# Altium schematic sheet Schematic.SchDoc
size A2
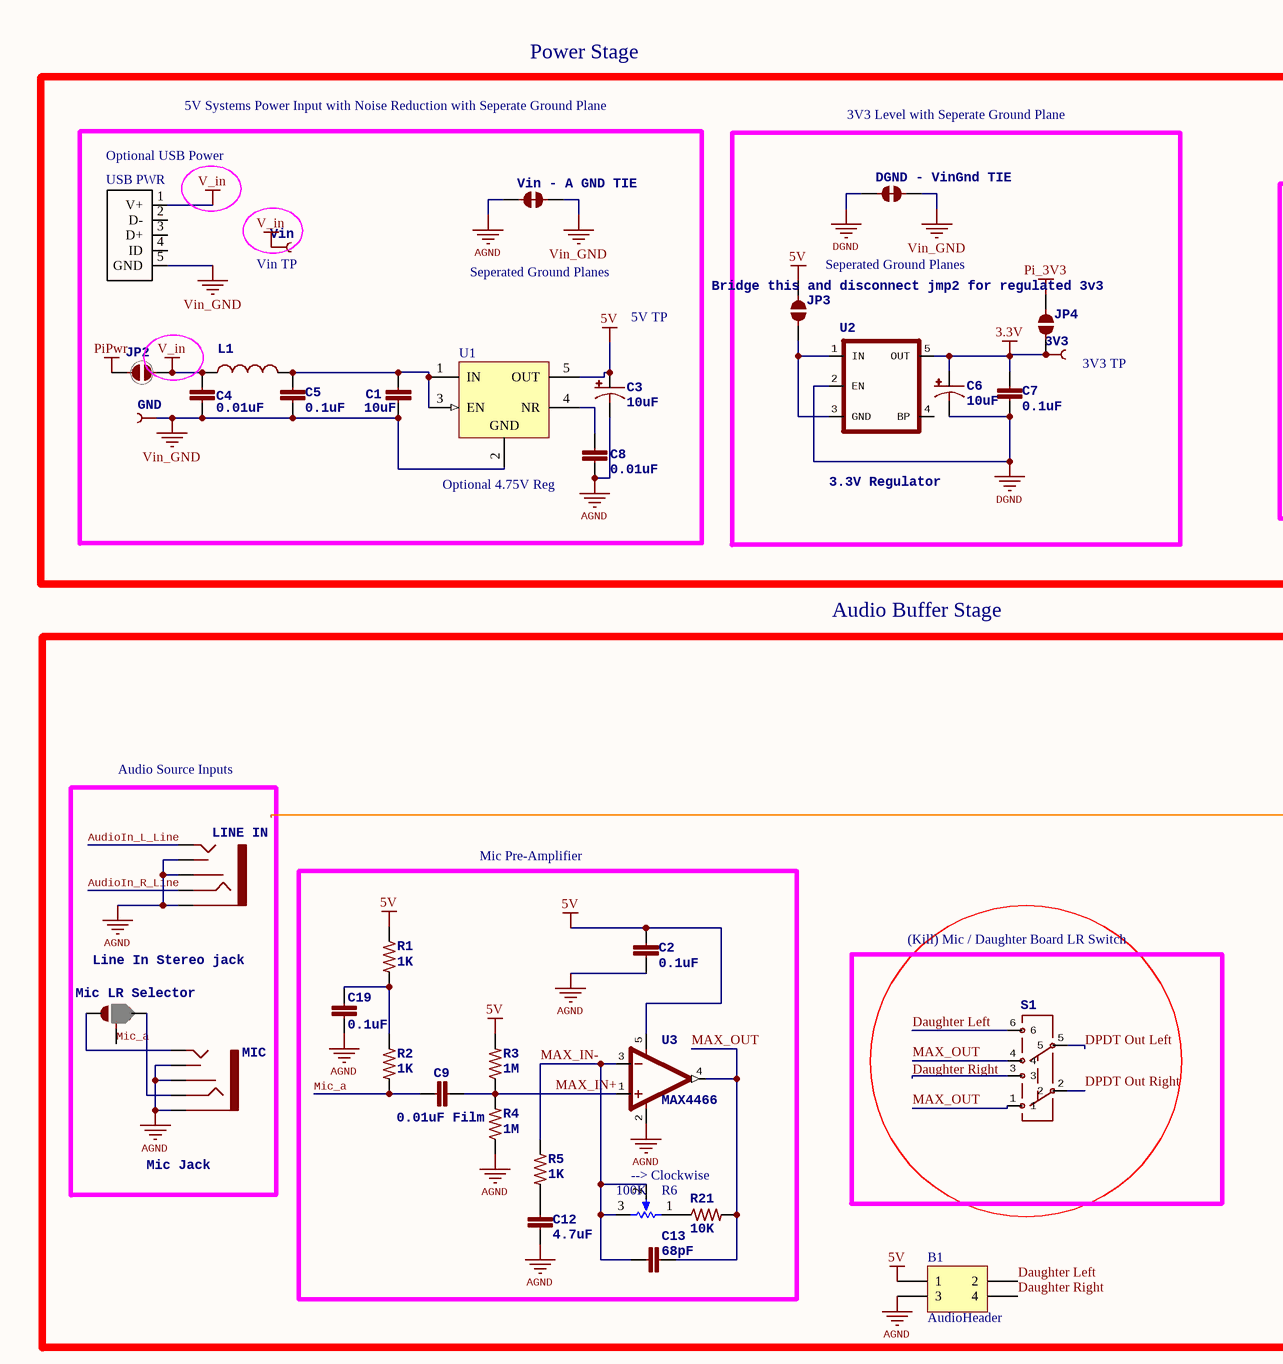
[diagram p0: Schematic.SchDoc, top left]
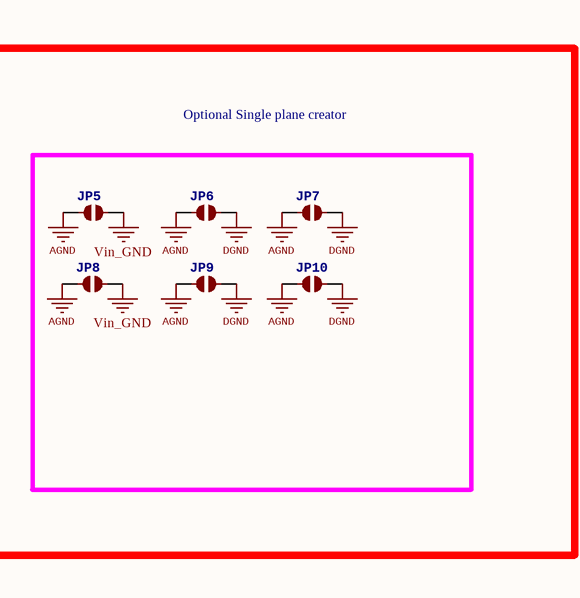
[diagram p1: Schematic.SchDoc, top right]
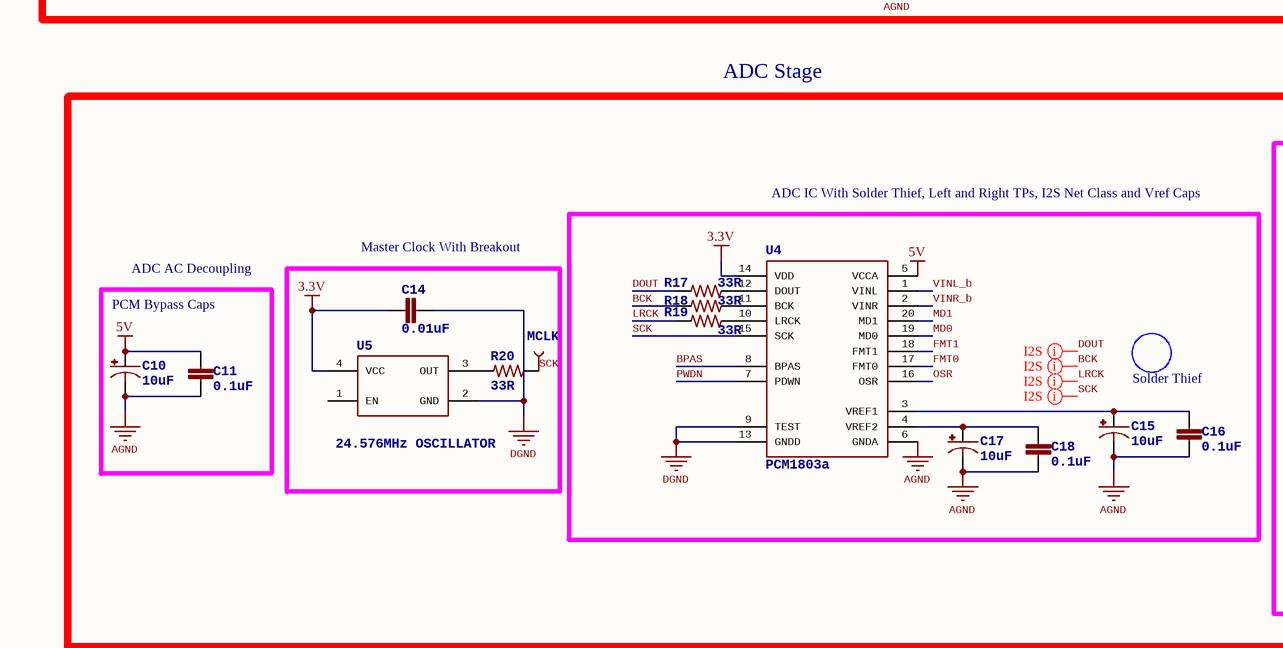
[diagram p2: Schematic.SchDoc, bottom left]
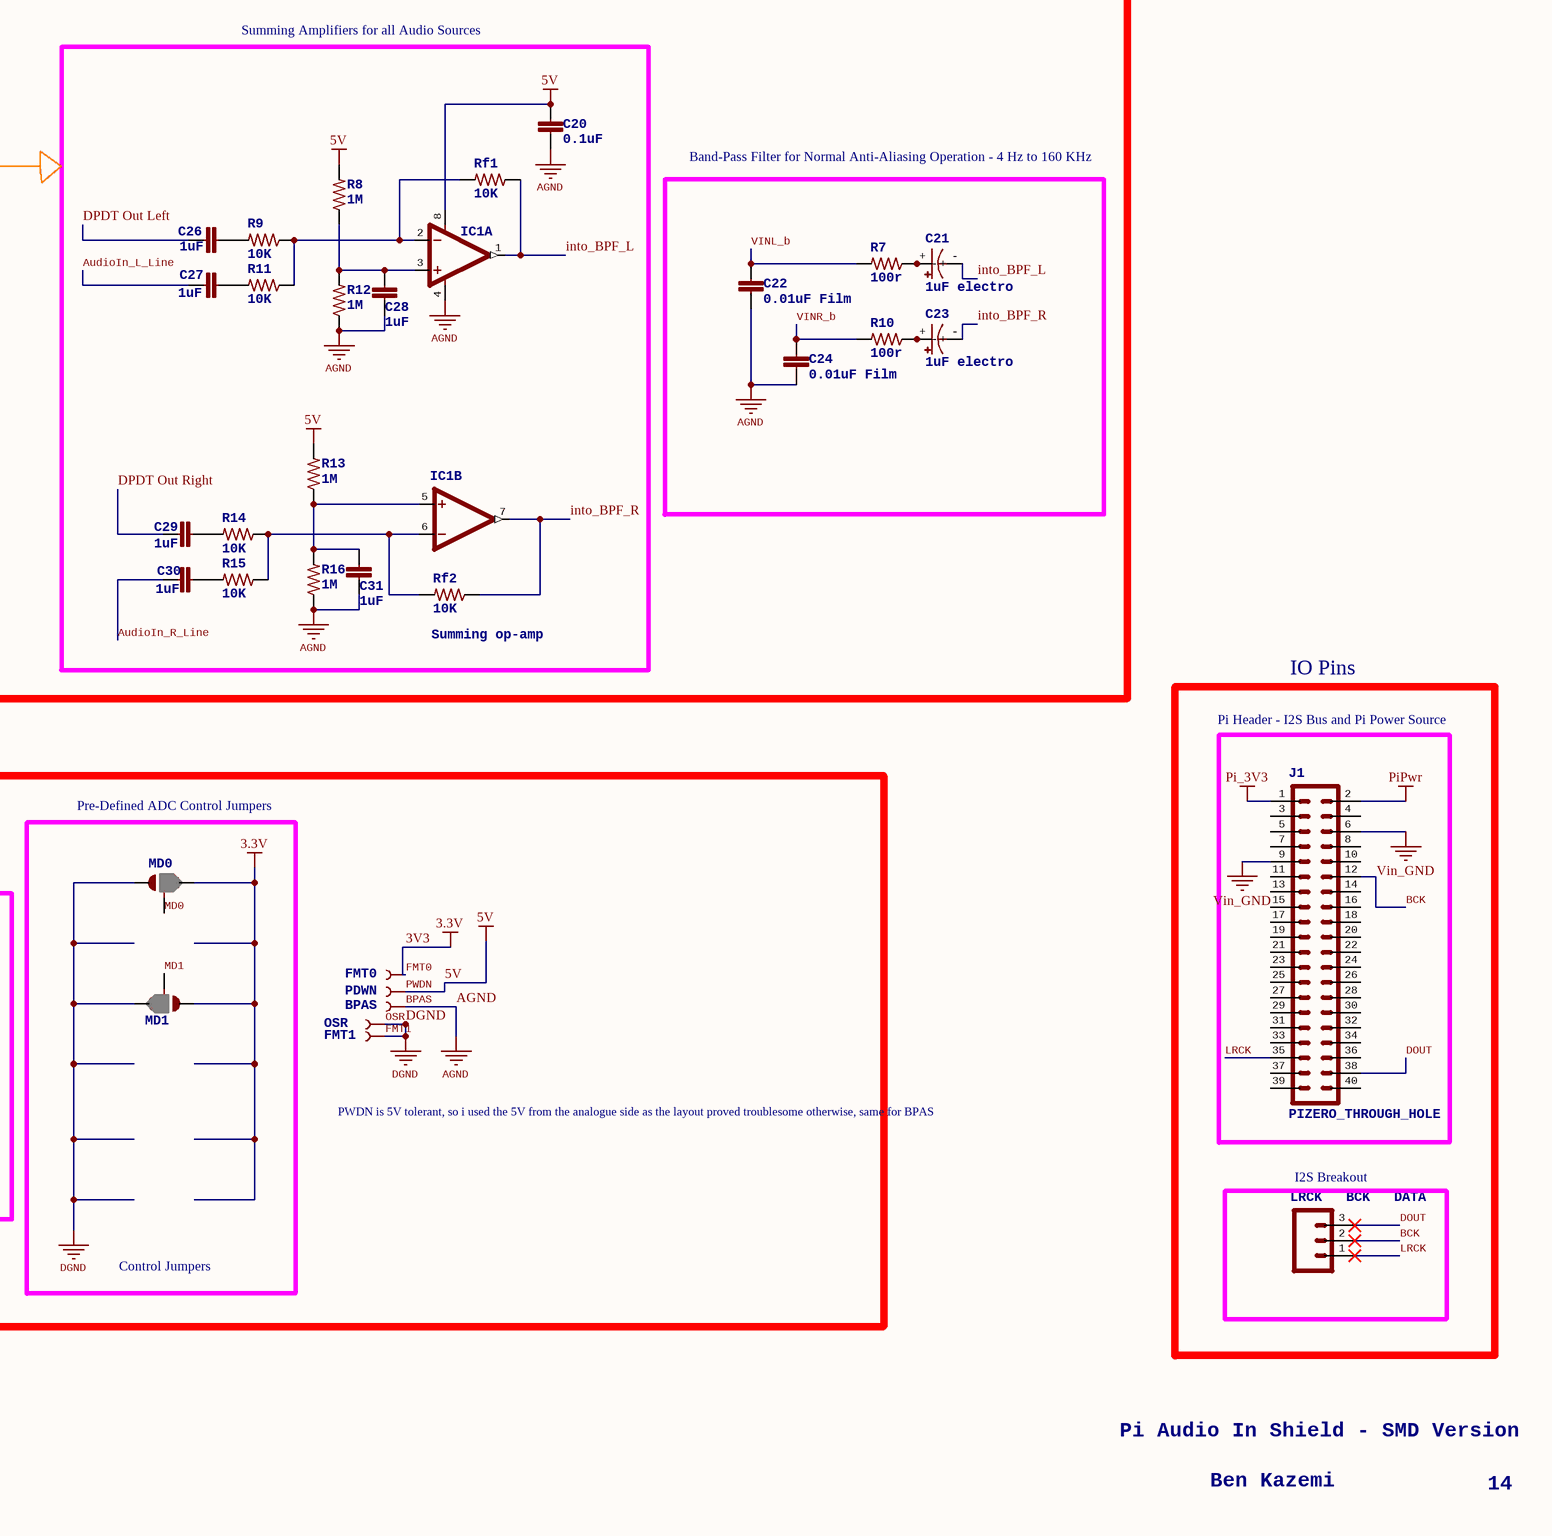
[diagram p3: Schematic.SchDoc, bottom right]

## Parts
3V3  Bare copper test points for troubleshooting or ICT  [PAD.03X.03]  (value not drawn)
B1  AudioHeader  [HDR2X2]
BPAS  Bare copper test points for troubleshooting or ICT  [PAD.02X.02]  (value not drawn)
C1  10uF  [0603-CAP]
C2  0.1uF  [0603-CAP]
C3  10uF  [EIA3216]
C4  0.01uF  [0603-CAP]
C5  0.1uF  [0603-CAP]
C6  10uF  [EIA3216]
C7  0.1uF  [0603-CAP]
C8  0.01uF  [0603-CAP]
C9  0.01uF Film  [C0805]
C10  10uF  [EIA3216]
C11  0.1uF  [0603-CAP]
C12  4.7uF  [0603-CAP]
C13  68pF  [0603-CAP]
C14  0.01uF  [0603-CAP]
C15  10uF  [EIA3216]
C16  0.1uF  [0603-CAP]
C17  10uF  [EIA3216]
C18  0.1uF  [0603-CAP]
C19  0.1uF  [0603-CAP]
C20  0.1uF  [0603-CAP]
C21  1uF electro  [PANASONIC_B_ELECTRO]
C22  0.01uF Film  [C0805]
C23  1uF electro  [PANASONIC_B_ELECTRO]
C24  0.01uF Film  [C0805]
C26  1uF  [0603-CAP]
C27  1uF  [0603-CAP]
C28  1uF  [0603-CAP]
C29  1uF  [0603-CAP]
C30  1uF  [0603-CAP]
C31  1uF  [0603-CAP]
DGND_-_VinGnd_TIE  JUMPER-PAD-2-NC_BY_TRACENO_SILK  [PAD-JUMPER-2-NC_BY_TRACE_NO_SILK]  (value not drawn)  (net tie, no BOM)
FMT0  Bare copper test points for troubleshooting or ICT  [PAD.02X.02]  (value not drawn)
FMT1  Bare copper test points for troubleshooting or ICT  [PAD.02X.02]  (value not drawn)
GND  Bare copper test points for troubleshooting or ICT  [PAD.03X.03]  (value not drawn)
IC1  Generic op-amp footprint  [MCHP-SOIC-OA8_M]  (value not drawn)  (parts A,B of 2)
J1  PIZERO_THROUGH_HOLE  [PIZERO_THOUGH_HOLE]
JP1  Mic LR Selector  [PAD-JUMPER-3-2OF3_NC_BY_PASTE_YES_SILK_FULL_BOX]  (net tie, no BOM)
JP2  (no value)  [PAD-JUMPER-2-NC_BY_PASTE_YES_SILK_FULL_BOX]  (net tie, no BOM)
JP3  Bridge this and disconnect jmp2 for regulated 3v3  [PAD-JUMPER-2-NO_NO_SILK]
JP4  Bridge this and disconnect jmp3 for pi 3v3  [PAD-JUMPER-2-NO_NO_SILK]  (value not drawn)  (net tie, no BOM)
JP5  (no value)  [PAD-JUMPER-2-NO_NO_SILK]  (net tie, no BOM)
JP6  (no value)  [PAD-JUMPER-2-NO_NO_SILK]  (net tie, no BOM)
JP7  (no value)  [PAD-JUMPER-2-NO_NO_SILK]  (net tie, no BOM)
JP8  (no value)  [PAD-JUMPER-2-NO_NO_SILK]  (net tie, no BOM)
JP9  (no value)  [PAD-JUMPER-2-NO_NO_SILK]  (net tie, no BOM)
JP10  (no value)  [PAD-JUMPER-2-NO_NO_SILK]  (net tie, no BOM)
L1  (no value)  [C0805]
LINE_IN  Line In Stereo jack  [AUDIO-JACK]
LRCK_BCK_DATA  Header 3Standard 3-pin 0.1" header. Use with straight break away headers (SKU : PRT-00116), right angle break away headers (PRT-00553), swiss pins (PRT-00743), machine pins (PRT-00117), and female headers (PRT-00115). Molex polarized connector foot print use with SKU : PRT-08232 with associated crimp pins and housings.  [1X03]  (value not drawn)
MCLK  (no value)  [PAD.03X.05]
MD0  (no value)  [PAD-JUMPER-3-2OF3_NC_BY_PASTE_YES_SILK_FULL_BOX]  (net tie, no BOM)
MD1  (no value)  [PAD-JUMPER-3-2OF3_NC_BY_PASTE_YES_SILK_FULL_BOX]  (net tie, no BOM)
MIC  Mic Jack  [AUDIO-JACK]
OSR  Bare copper test points for troubleshooting or ICT  [PAD.02X.02]  (value not drawn)
PDWN  Bare copper test points for troubleshooting or ICT  [PAD.02X.02]  (value not drawn)
R1  1K  [0603-RES]
R2  1K  [0603-RES]
R3  1M  [0603-RES]
R4  1M  [0603-RES]
R5  1K  [0603-RES]
R6  100K  [Trimmer]
R7  100r  [0603-RES]
R8  1M  [0603-RES]
R9  10K  [0603-RES]
R10  100r  [0603-RES]
R11  10K  [0603-RES]
R12  1M  [0603-RES]
R13  1M  [0603-RES]
R14  10K  [0603-RES]
R15  10K  [0603-RES]
R16  1M  [0603-RES]
R17  33R  [6-0805_L]
R18  33R  [6-0805_L]
R19  33R  [6-0805_L]
R20  33R  [6-0805_L]
R21  10K  [0603-RES]
Rf1  10K  [0603-RES]
Rf2  10K  [0603-RES]
S1  (no value)  [MHS222 DPDT Side]
Thief1  Solder Thief  [SOP Solder Thief]
U1  Optional 4.75V Reg  [TI-DBV5_N]
U2  3.3V Regulator  [TI-DBV5_N]
U3  MAX4466  [SC70-LT5_N]
U4  PCM1803a  [SSOP20]
U5  24.576MHz OSCILLATOR  [3.2x2.5 Osc]
USB_PWR  Optional USB Power  [MicroUSB-HRS1]
Vin  Bare copper test points for troubleshooting or ICT  [PAD.03X.03]  (value not drawn)
Vin_-_A_GND_TIE  JUMPER-PAD-2-NC_BY_TRACENO_SILK  [PAD-JUMPER-2-NC_BY_TRACE_NO_SILK]  (value not drawn)  (net tie, no BOM)

## Blocks framed on the sheet
Power Stage: 3V3 C1 C3-C8 DGND_-_VinGnd_TIE GND JP2-JP10 L1 U1 U2 USB_PWR Vin Vin_-_A_GND_TIE
Audio Buffer Stage: B1 C2 C9 C12 C13 C19 C21-C24 R1-R7 R10 R21 U3
Summing Amplifiers for all Audio Sources: C20 C26-C31 IC1 R8 R9 R11-R16 Rf1 Rf2
Audio Source Inputs: JP1 LINE_IN MIC
(Kill) Mic / Daughter Board LR Switch: S1
Pi Header - I2S Bus and Pi Power Source: J1
ADC Stage: BPAS C10 C11 C15-C18 FMT0 FMT1 MD0 MD1 OSR PDWN R17-R19 Thief1 U4
Master Clock With Breakout: C14 MCLK R20 U5
I2S Breakout: LRCK_BCK_DATA

## Nets
3V3: 3V3.P$1 C6.A(+) C7.1 C14.1 FMT0.P$1 JP4.1 MD0.3 MD1.1 U2.5(OUT) U4.14(VDD) U4.17(FMT0) U5.4(VCC)  [also labelled 3.3V, FMT0]
5V: B1.1 C2.1 C3.A(+) C10.A(+) C11.1 C20.1 IC1.8(V+) JP3.2 PDWN.P$1 R1.1 R3.2 R8.2 R13.2 U1.5(OUT) U3.5(V+) U4.5(VCCA) U4.7(PDWN)  [also labelled PWDN]
AGND: B1.3 BPAS.P$1 C2.2 C3.C(-) C8.2 C10.C(-) C11.2 C12.2 C15.C(-) C16.2 C17.C(-) C18.2 C19.2 C20.2 C22.2 C24.2 C28.2 C31.2 IC1.4(V-) JP5.1 JP6.1 JP7.1 JP8.1 JP9.1 JP10.1 LINE_IN.RSH LINE_IN.SLEEVE LINE_IN.TSH MIC.RSH MIC.SLEEVE MIC.TSH R4.1 R12.1 R16.1 U3.2(V-) U4.6(GNDA) U4.8(BPAS) Vin_-_A_GND_TIE.1  [also labelled BPAS]
DGND: C6.C(-) C7.2 C14.2 DGND_-_VinGnd_TIE.1 FMT1.P$1 JP6.2 JP7.2 JP9.2 JP10.2 MD0.1 MD1.3 OSR.P$1 U2.2(EN) U4.9(TEST) U4.13(GNDD) U4.16(OSR) U4.18(FMT1) U5.2(GND)  [also labelled FMT1, OSR]
Pi_3V3: J1.1 JP4.2
PiPwr: J1.2 JP2.1
V_in: C4.1 JP2.2 L1.1 USB_PWR.1(V+) Vin.P$1
Vin_GND: C1.2 C4.2 C5.2 DGND_-_VinGnd_TIE.2 GND.P$1 J1.6 J1.9 JP5.2 JP8.2 U1.2(GND) USB_PWR.5(GND) Vin_-_A_GND_TIE.2
AudioIn_L_Line: C27.1 LINE_IN.TIP
AudioIn_R_Line: C30.1 LINE_IN.RING
BCK: J1.12 LRCK_BCK_DATA.2 R18.2
Daughter Left: B1.2 S1.6
Daughter Right: B1.4 S1.3
DOUT: J1.38 LRCK_BCK_DATA.3 R17.2
DPDT Out Left: C26.1 S1.5
DPDT Out Right: C29.1 S1.2
into_BPF_L: C21.- IC1.1(OUT) Rf1.1
into_BPF_R: C23.- IC1.7(OUT) Rf2.1
LRCK: J1.35 LRCK_BCK_DATA.1 R19.2
MAX_IN+: C9.2 R3.1 R4.2 U3.1(+IN)
MAX_IN-: C13.1 R5.1 R6.2(TAP) R6.3(BOT) U3.3(-IN)
MAX_OUT: C13.2 R21.2 S1.1 S1.4 U3.4(OUT)
MD0: MD0.2 U4.19(MD0)
MD1: MD1.2 U4.20(MD1)
Mic_a: C9.1 JP1.2 R2.2
SCK: MCLK.P$1 R20.1 U4.15(SCK)
VINL_b: C22.1 R7.2 U4.1(VINL)
VINR_b: C24.1 R10.2 U4.2(VINR)
NetC1_1: C1.1 C5.1 L1.2 U1.1(IN) U1.3(EN)
NetC8_1: C8.1 U1.4(NR)
NetC12_1: C12.1 R5.2
NetC15_A: C15.A(+) C16.1 U4.3(VREF1)
NetC17_A: C17.A(+) C18.1 U4.4(VREF2)
NetC19_1: C19.1 R1.2 R2.1
NetC21_+: C21.+ R7.1
NetC23_+: C23.+ R10.1
NetC26_2: C26.2 R9.2
NetC27_2: C27.2 R11.2
NetC28_1: C28.1 IC1.3(+IN) R8.1 R12.2
NetC29_2: C29.2 R14.2
NetC30_2: C30.2 R15.2
NetC31_1: C31.1 IC1.5(+IN) R13.1 R16.2
NetIC1_2: IC1.2(-IN) R9.1 R11.1 Rf1.2
NetIC1_6: IC1.6(-IN) R14.1 R15.1 Rf2.2
NetJP1_1: JP1.1 MIC.TIP
NetJP1_3: JP1.3 MIC.RING
NetJP3_1: JP3.1 U2.1(IN) U2.3(GND)
NetR6_1: R6.1(TOP) R21.1
NetR17_1: R17.1 U4.12(DOUT)
NetR18_1: R18.1 U4.11(BCK)
NetR19_1: R19.1 U4.10(LRCK)
NetR20_2: R20.2 U5.3(OUT)

Not connected (* = marked no-connect by the designer): J1 3 4 5 7 8 10 11 13 14 15 16 17 18 19 20 21 22 23 24 25 26 27 28 29 30 31 32 33 34 36 37 39 40; U2 4(BP); U5 1(EN); USB_PWR 2(D-) 3(D+) 4(ID)

## Layout directives
net class I2S: (no net found under the mark)

## Notes on the sheet
- 5V Systems Power Input with Noise Reduction with Seperate Ground Plane
- 3V3 Level with Seperate Ground Plane
- Optional Single plane creator
- (near Vin) Vin TP
- Seperated Ground Planes
- (near JP3) Seperated Ground Planes
- 5V TP
- 3V3 TP
- Band-Pass Filter for Normal Anti-Aliasing Operation - 4 Hz to 160 KHz
- Mic Pre-Amplifier
- (near R6) --> Clockwise
- IO Pins
- Pre-Defined ADC Control Jumpers
- ADC IC With Solder Thief, Left and Right TPs, I2S Net Class and Vref Caps
- PCM Bypass Caps
- ADC AC Decoupling
- PWDN is 5V tolerant, so i used the 5V from the analogue side as the layout proved troublesome otherwise, same for BPAS
- Control Jumpers
- Pi Audio In Shield - SMD Version
- Ben Kazemi
- 14
- Labels drawn without touching a wire or pin: BCK, DOUT, LRCK, SCK

## Library data of the parts
3V3 GND Vin = TEST-POINT3
B1 = Header 2X2: Header, 2-Pin, Dual row; LatestRevisionDate: 17-Jul-2002; LatestRevisionNote: Re-released for DXP Platform.; Publisher: Altium Limited
BPAS FMT0 FMT1 OSR PDWN = TEST-POINT2
C1 C2 C4 C5 C7 C8 C11 C14 C16 C18 C26-C31 = 0.1UF-25V-5%(0603): Part#: assortment; Picked: true; Type: ceramic
  C1 C2 C5 C7 C11 C16 C18 C26-C31: Cost: 0.023
  C4 C8 C14: Cost: 0.025
C3 C6 C10 C15 C17 = CAP_POL1206: Capacitor PolarizedThese are standard SMD and PTH capacitors. Normally 10uF, 47uF, and 100uF in electrolytic and tantalum varieties. Always verify the external diameter of the through hole cap, it varies with capacity, voltage, and manufacturer. The EIA devices should be standard.; Part#: Vishay 10μF 16 V dc Tantalum Capacitor MnO2 Solid ±10% tolerance 593D series; Picked: awaiting; Type: tantalum; Site: http://uk.rs-online.com/web/p/tantalum-capacitors/6844443/; Datasheet: http://uk.rs-online.com/webdocs/0d97/0900766b80d97c10.pdf
  C15 C17: Cost: 0.227
C9 C22 C24 = CAP0805
C12 C19 = 0.1UF-25V-5%(0603): Part#: MC0603X105K100CT; Picked: true; Type: Ceramic; Site: http://uk.farnell.com/multicomp/mc0603x105k100ct/cap-mlcc-x5r-1uf-10v-0603/dp/1759399; Datasheet: http://www.farnell.com/datasheets/1901289.pdf?_ga=1.114965572.2111588679.1477695937; Cost: 0.0121
C13 = 0.1UF-25V-5%(0603): Part#: assortment; Picked: true; Type: Ceramic; Cost: 0.05
C20 = 0.1UF-25V-5%(0603): Part#: assortment; PROD_ID: CAP-08604; Picked: true; Type: ceramic; Cost: 0.023
C21 C23 = CAP_POLC: Capacitor PolarizedThese are standard SMD and PTH capacitors. Normally 10uF, 47uF, and 100uF in electrolytic and tantalum varieties. Always verify the external diameter of the through hole cap, it varies with capacity, voltage, and manufacturer. The EIA devices should be standard.; Part#: EEE1HA1R0AR; Picked: true; Type: electrolytic; Site: http://uk.farnell.com/webapp/wcs/stores/servlet/ProductDisplay?catalogId=15001&langId=44&urlRequestType=Base&partNumber=2326149&storeId=10151; Datasheet: http://www.farnell.com/datasheets/2059976.pdf?_ga=1.185817706.2111588679.1477695937; Cost: 0.115
IC1 = OPAMP-DUALU: Part#: MCP6402-E/SN; Picked: false; Site: http://uk.farnell.com/microchip/mcp6402-e-sn/ic-op-amp-dual-1mhz-1-8v-8soic/dp/1833437; Datasheet: http://www.farnell.com/datasheets/1669483.pdf?_ga=1.148070260.2111588679.1477695937; Cost: 0.387
JP1 MD0 MD1 = JUMPER-PAD-3-2OF3_NC_BY_PASTE
JP2 = JUMPER-PAD-2-NC_BY_PASTEFULL-BOX-SILK
JP3-JP10 = JUMPER-PAD-2-NO
L1 = INDUCTOR0805: Inductors   Basic Inductor/Choke - 0603 and 1206. Footprints are not proven and vary greatly between part numbers. INDUCTOR POWER 3.3UH 4.0A SMD 0.197" L x 0.197" W x 0.177" H (5.00mm x 5.00mm x 4.50mm); Part#: mpz2012s331a; Picked: true; Datasheet: http://www.farnell.com/datasheets/55169.pdf?_ga=1.185637866.2111588679.1477695937; Site: https://uk.farnell.com/webapp/wcs/stores/servlet/ProductDisplay?catalogId=15001&CMP=i-ddd7-00001003&langId=44&storeId=10151&krypto=bBMrL5yVwIWI6u6Yca2X37o31oBvpgYGX66w9sSnKmrTVf6dRWZkStNvtfBlA%2BxcZyCJrovIgVW5IV9XR9GO%2BnYYLBu6Vx6claKpfbiAkEiOIN6Kh5mWTnuG6WiCqOMd8E3SWVDAErVMuxMPX5%2BXzQ%3D%3D&ddkey=http%3Aen-GB%2FElement14_United_Kingdom%2Ftdk%2Fmpz2012s331at000%2Fferrite-bead-0-05ohm-2-5a-0805%2Fdp%2F1301679; Cost: 0.0832
LINE_IN MIC = AUDIO-JACK2PTH: Part#: 35RAPC4BHN2; Picked: true; Site: http://uk.farnell.com/webapp/wcs/stores/servlet/ProductDisplay?catalogId=15001&langId=44&urlRequestType=Base&partNumber=1608405&storeId=10151; Datasheet: http://www.farnell.com/datasheets/1718833.pdf?_ga=1.139024112.2111588679.1477695937; Cost: 0.580
LRCK_BCK_DATA = M03PTH
MCLK = TEST-POINT3X5
R1 R2 = 2.0KOHM1/10W5%(0603): PROD_ID: RES-08296
R3 R4 R7-R16 = RESISTOR0603: ResistorBasic schematic elements and footprints for 0603, 1206, and PTH resistors.; Picked: awaiting; Site: http://uk.rs-online.com/web/p/surface-mount-fixed-resistors/6662279/; Type: thin film; Datasheet: http://uk.rs-online.com/webdocs/0d1c/0900766b80d1cb2c.pdf; Cost: 0.064
R5 R21 = RESISTOR0603-RES: Part#: assortment; Picked: true; Type: Film; Cost: 0.02
R6 = RPot: Potentiometer; Part#: TC33X-2-104E; Picked: awaiting; Type: Variable; Datasheet: http://www.farnell.com/datasheets/2146212.pdf?_ga=1.118191818.2111588679.1477695937; Site: http://uk.farnell.com/bourns/tc33x-2-104e/trimmer-100k-3mm/dp/1689864; Cost: 0.302
R17-R20 = RESISTOR0805-RES
Rf1 Rf2 = RESISTOR0603: ResistorBasic schematic elements and footprints for 0603, 1206, and PTH resistors.; Picked: false; Type: thin film; Cost: 0.05
S1 = SWITCH-DPDTPTH1
Thief1 = Solder Thief SOP
U1 = TPS793475DBVR: Single Output High PSRR LDO, 200 mA, Fixed 4.75 V Output, 2.7 to 5.5 V Input, 5-pin SOT-23 (DBV), -40 to 85 degC, Green (RoHS & no Sb/Br); Manufacturer: Texas Instruments; Accuracy(%): 2; Fixed Output Options(V): 4.75; Iout(Max)(A): 0.2; Rating: Catalog; SubFamily: Single Channel LDO; Vdo(Typ)(mV): 77; Vin(Max)(V): 5.5; Vin(Min)(V): 2.7; DatasheetVersion: SLVS348K; PackageVersion: 4073253-4/K; PackageReference: DBV5; PackageDescription: 5-Pin Plastic Small Outline, Body 1.60 Ã— 2.90 mm, Pitch 0.95 mm; Supplier 1: Digi-Key; Supplier Part Number 1: 296-12160-2-ND; Supplier 2: Digi-Key; Supplier Part Number 2: 296-12160-1-ND; Supplier 3: Digi-Key; Supplier Part Number 3: 296-12160-6-ND; Supplier 4: Newark; Supplier Part Number 4: 77C1366; Supplier 5: Mouser; Supplier Part Number 5: 595-TPS793475DBVR; Eco-Plan: Green (RoHS & no Sb/Br); Iq(Typ)(mA): 0.2; Vout Adj(Max)(V): 4.75; Vout Adj(Min)(V): 4.75; Mounting Technology: Surface Mount; Code_JEDEC: MO-178; PartNumber: TPS793475DBVR; ComponentLink1Description: Manufacturer URL; ComponentLink1URL: http://www.ti.com/; ComponentLink2Description: Datasheet; ComponentLink2URL: http://www.ti.com/general/docs/lit/getliterature.tsp?genericPartNumber=TPS793475&fileType=pdf; ComponentLink3Description: Package Specification; ComponentLink3URL: http://www.ti.com/litv/pdf/mpds018i; ComponentLink4Description: URL Link1; ComponentLink4URL: Samples URL:http://www.ti.com/product/tps793475#samples
U2 = MIC52053.3V: Part#: MIC5205-3.3YM5-TR; Picked: true; Site: http://uk.farnell.com/webapp/wcs/stores/servlet/ProductDisplay?catalogId=15001&langId=44&urlRequestType=Base&partNumber=2510222&storeId=10151; Datasheet: http://www.farnell.com/datasheets/29605.pdf?_ga=1.85606106.2111588679.1477695937; Cost: 0.317
U3 = OPA344: Single gate rail-to-rail output op-amp. Inputs extend 300mV past rails.; Part#: MAX4466EXK+T; Picked: true; Site: http://uk.farnell.com/webapp/wcs/stores/servlet/ProductDisplay?catalogId=15001&langId=44&urlRequestType=Base&partNumber=2514501&storeId=10151; Datasheet: http://www.farnell.com/datasheets/2001217.pdf?_ga=1.73481169.2111588679.1477695937; Cost: 0.412
U4 = PCM1803SMD: 24-bit ADC; Part#: PCM1803ADB; Picked: true; Site: https://uk.rs-online.com/web/p/audio-adcs/6604409/?searchTerm=660-4409&relevancy-data=636F3D3126696E3D4931384E525353746F636B4E756D6265724D504E266C753D656E266D6D3D6D61746368616C6C26706D3D5E283F69292852537C5253207C52532D293F5C647B337D285C73293F5B5C732D2F255C2E2C5D285C73293F5C647B332C347D2426706F3D313426736E3D592673743D52535F53544F434B5F4E554D4245522677633D4E4F4E45267573743D3636302D34343039267374613D3636303434303926; Datasheet: http://www.ti.com/lit/ds/symlink/pcm1803a.pdf; Cost: 2.04
U5 = OSCILLATORSMD6: Part#: FXO-HC736R-24.576; Picked: true; Cost: 1.19; Site: http://uk.farnell.com/webapp/wcs/stores/servlet/ProductDisplay?catalogId=15001&langId=44&urlRequestType=Base&partNumber=1641004&storeId=10151; Datasheet: http://www.farnell.com/datasheets/75456.pdf?_ga=1.73022288.2111588679.1477695937
USB_PWR = MicroUSB-HRS-ZX62-AB-5PA: Part#: assortment; Picked: true; Best.Nr (Farnell): 1645326; HelpURL: http://www.farnell.com/datasheets/81390.pdf; Cost: 0.45